# Altium schematic sheet main.SchDoc
size 420 x 297 mm; Address1: Address1; Address2: Address2; Address3: Address3; Address4: Address4; DocumentNumber: АБВГ.123456.001 Э3; SheetNumber: 1; SheetTotal: 7; Scale: 1:1; DocumentType: Схема электрическая принципиальная; FirstReferrence: АБВГ.123456.001
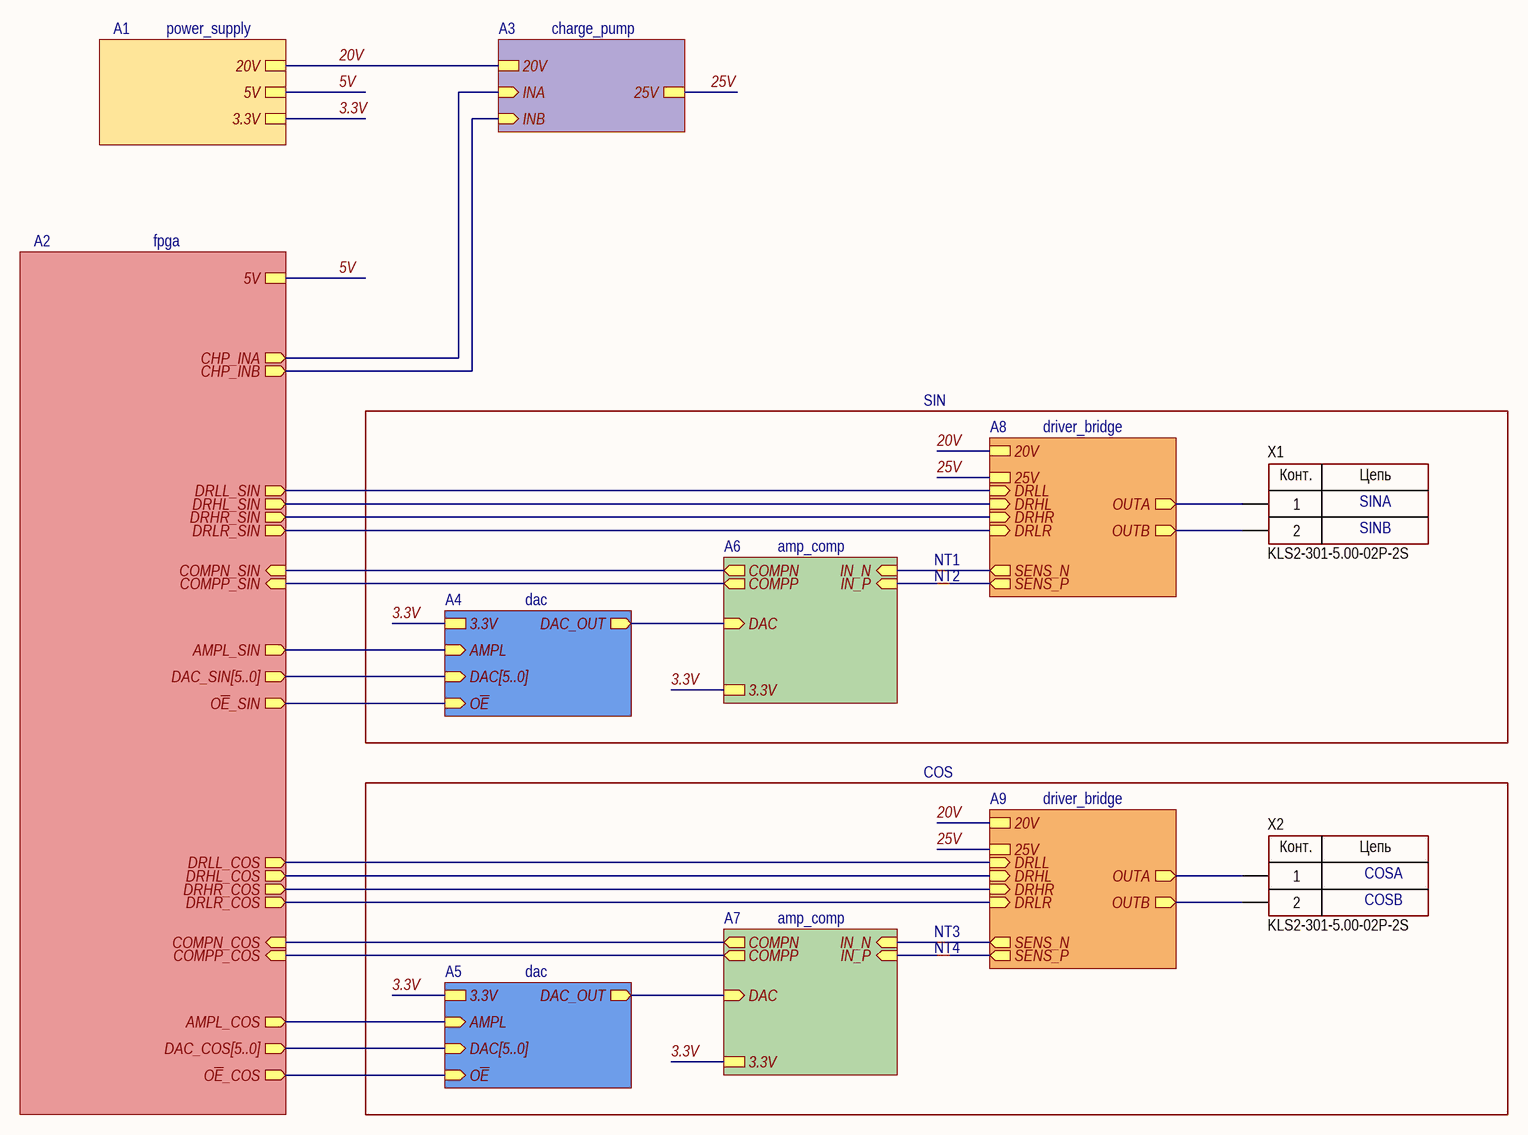
[diagram p0: main.SchDoc]

## Parts
NT1  Net_Tie  [NET TIE 0.5_1.5]  (value not drawn)
NT2  Net_Tie  [NET TIE 0.5_1.5]  (value not drawn)
NT3  Net_Tie  [NET TIE 0.5_1.5]  (value not drawn)
NT4  Net_Tie  [NET TIE 0.5_1.5]  (value not drawn)
X1  CommentText: KLS2-301-5.00-02P-2S  [CON: Terminal 2p 5mm]
X2  CommentText: KLS2-301-5.00-02P-2S  [CON: Terminal 2p 5mm]

## Sub-sheets
A1 = power_supply: 3.3V, 5V, 20V
A2 = fpga: CHP_INA (out), 5V, DAC_SIN[5..0] (out), COMPN_SIN (in), COMPP_SIN (in), DRLR_SIN (out), DRHR_SIN (out), DRHL_SIN (out), DRLL_SIN (out), DRLL_COS (out), DRHL_COS (out), DRHR_COS (out), DRLR_COS (out), DAC_COS[5..0] (out), AMPL_SIN (out), O~{E}_SIN (out), AMPL_COS (out), O~{E}_COS (out), COMPN_COS (in), COMPP_COS (in), CHP_INB (out)
A3 = charge_pump: 20V, 25V, INA (in), INB (in)
A4 = dac: 3.3V, DAC_OUT (out), DAC[5..0] (in), AMPL (in), O~{E} (in)
A5 = dac: 3.3V, DAC_OUT (out), DAC[5..0] (in), AMPL (in), O~{E} (in)
A6 = amp_comp: 3.3V, DAC (in), COMPN (out), COMPP (out), IN_N (in), IN_P (in)
A7 = amp_comp: 3.3V, DAC (in), COMPN (out), COMPP (out), IN_N (in), IN_P (in)
A8 = driver_bridge: 20V, 25V, OUTA (out), OUTB (out), SENS_N (out), SENS_P (out), DRLL (in), DRHL (in), DRHR (in), DRLR (in)
A9 = driver_bridge: 20V, 25V, OUTA (out), OUTB (out), SENS_N (out), SENS_P (out), DRLL (in), DRHL (in), DRHR (in), DRLR (in)

## Nets
3.3V: sheet A6/3.3V, sheet A4/3.3V, sheet A1/3.3V, sheet A7/3.3V, sheet A5/3.3V
5V: sheet A1/5V, sheet A2/5V
20V: sheet A3/20V, sheet A8/20V, sheet A1/20V, sheet A9/20V
25V: sheet A3/25V, sheet A8/25V, sheet A9/25V
NetNT1_1: NT1.1 ; sheet A6/IN_N
NetNT1_2: NT1.2 ; sheet A8/SENS_N
NetNT2_1: NT2.1 ; sheet A6/IN_P
NetNT2_2: NT2.2 ; sheet A8/SENS_P
NetNT3_1: NT3.1 ; sheet A7/IN_N
NetNT3_2: NT3.2 ; sheet A9/SENS_N
NetNT4_1: NT4.1 ; sheet A7/IN_P
NetNT4_2: NT4.2 ; sheet A9/SENS_P
NetX1_1: X1.1 ; sheet A8/OUTA
NetX1_2: X1.2 ; sheet A8/OUTB
NetX2_1: X2.1 ; sheet A9/OUTA
NetX2_2: X2.2 ; sheet A9/OUTB
(unnamed): sheet A3/INA, sheet A2/CHP_INA
(unnamed): sheet A3/INB, sheet A2/CHP_INB
(unnamed): sheet A8/DRLL, sheet A2/DRLL_SIN
(unnamed): sheet A8/DRHL, sheet A2/DRHL_SIN
(unnamed): sheet A8/DRHR, sheet A2/DRHR_SIN
(unnamed): sheet A8/DRLR, sheet A2/DRLR_SIN
(unnamed): sheet A6/DAC, sheet A4/DAC_OUT
(unnamed): sheet A6/COMPN, sheet A2/COMPN_SIN
(unnamed): sheet A6/COMPP, sheet A2/COMPP_SIN
(unnamed): sheet A4/AMPL, sheet A2/AMPL_SIN
(unnamed): sheet A4/O~{E}, sheet A2/O~{E}_SIN
(unnamed): sheet A2/DRLL_COS, sheet A9/DRLL
(unnamed): sheet A2/DRHL_COS, sheet A9/DRHL
(unnamed): sheet A2/DRHR_COS, sheet A9/DRHR
(unnamed): sheet A2/DRLR_COS, sheet A9/DRLR
(unnamed): sheet A2/AMPL_COS, sheet A5/AMPL
(unnamed): sheet A2/O~{E}_COS, sheet A5/O~{E}
(unnamed): sheet A2/COMPN_COS, sheet A7/COMPN
(unnamed): sheet A2/COMPP_COS, sheet A7/COMPP
(unnamed): sheet A7/DAC, sheet A5/DAC_OUT

## Buses and harness runs
bus sheet A2/DAC_COS[5..0] = sheet A5/DAC[5..0]
bus sheet A2/DAC_SIN[5..0] = sheet A4/DAC[5..0]

## Notes on the sheet
- SIN
- SINA
- SINB
- COS
- COSA
- COSB
- Перв. примен.
- Справ. №
- Подп. и дата
- Инв. № дубл.
- Взам. инв. №
- Разраб.
- Изм.
- Лист
- № докум.
- Подп.
- Дата
- Лит.
- Масса
- Масштаб
- Пров.
- Т.контр.
- Листов
- Инв. № подл.
- Утв.
- Н.контр.
- 2.106-A3
- Копировал
- Формат А3
- (in symbol Terminal block 2) Конт.; Цепь

## Library data of the parts
X1 X2 = Terminal block 2: ValueManufacturerPartNumber: Connector, 2pin, *, *, *; TypeConnector: Connector; Multichannel: 2pin; Manufacturer: *; HelpURL: *; PartNumber: KLS2-301-5.00-02P-2S; VoltageMax: *; Pitch: *; CurrentMax: *